# EAGLE design untitled (EAGLE 9.6.2)
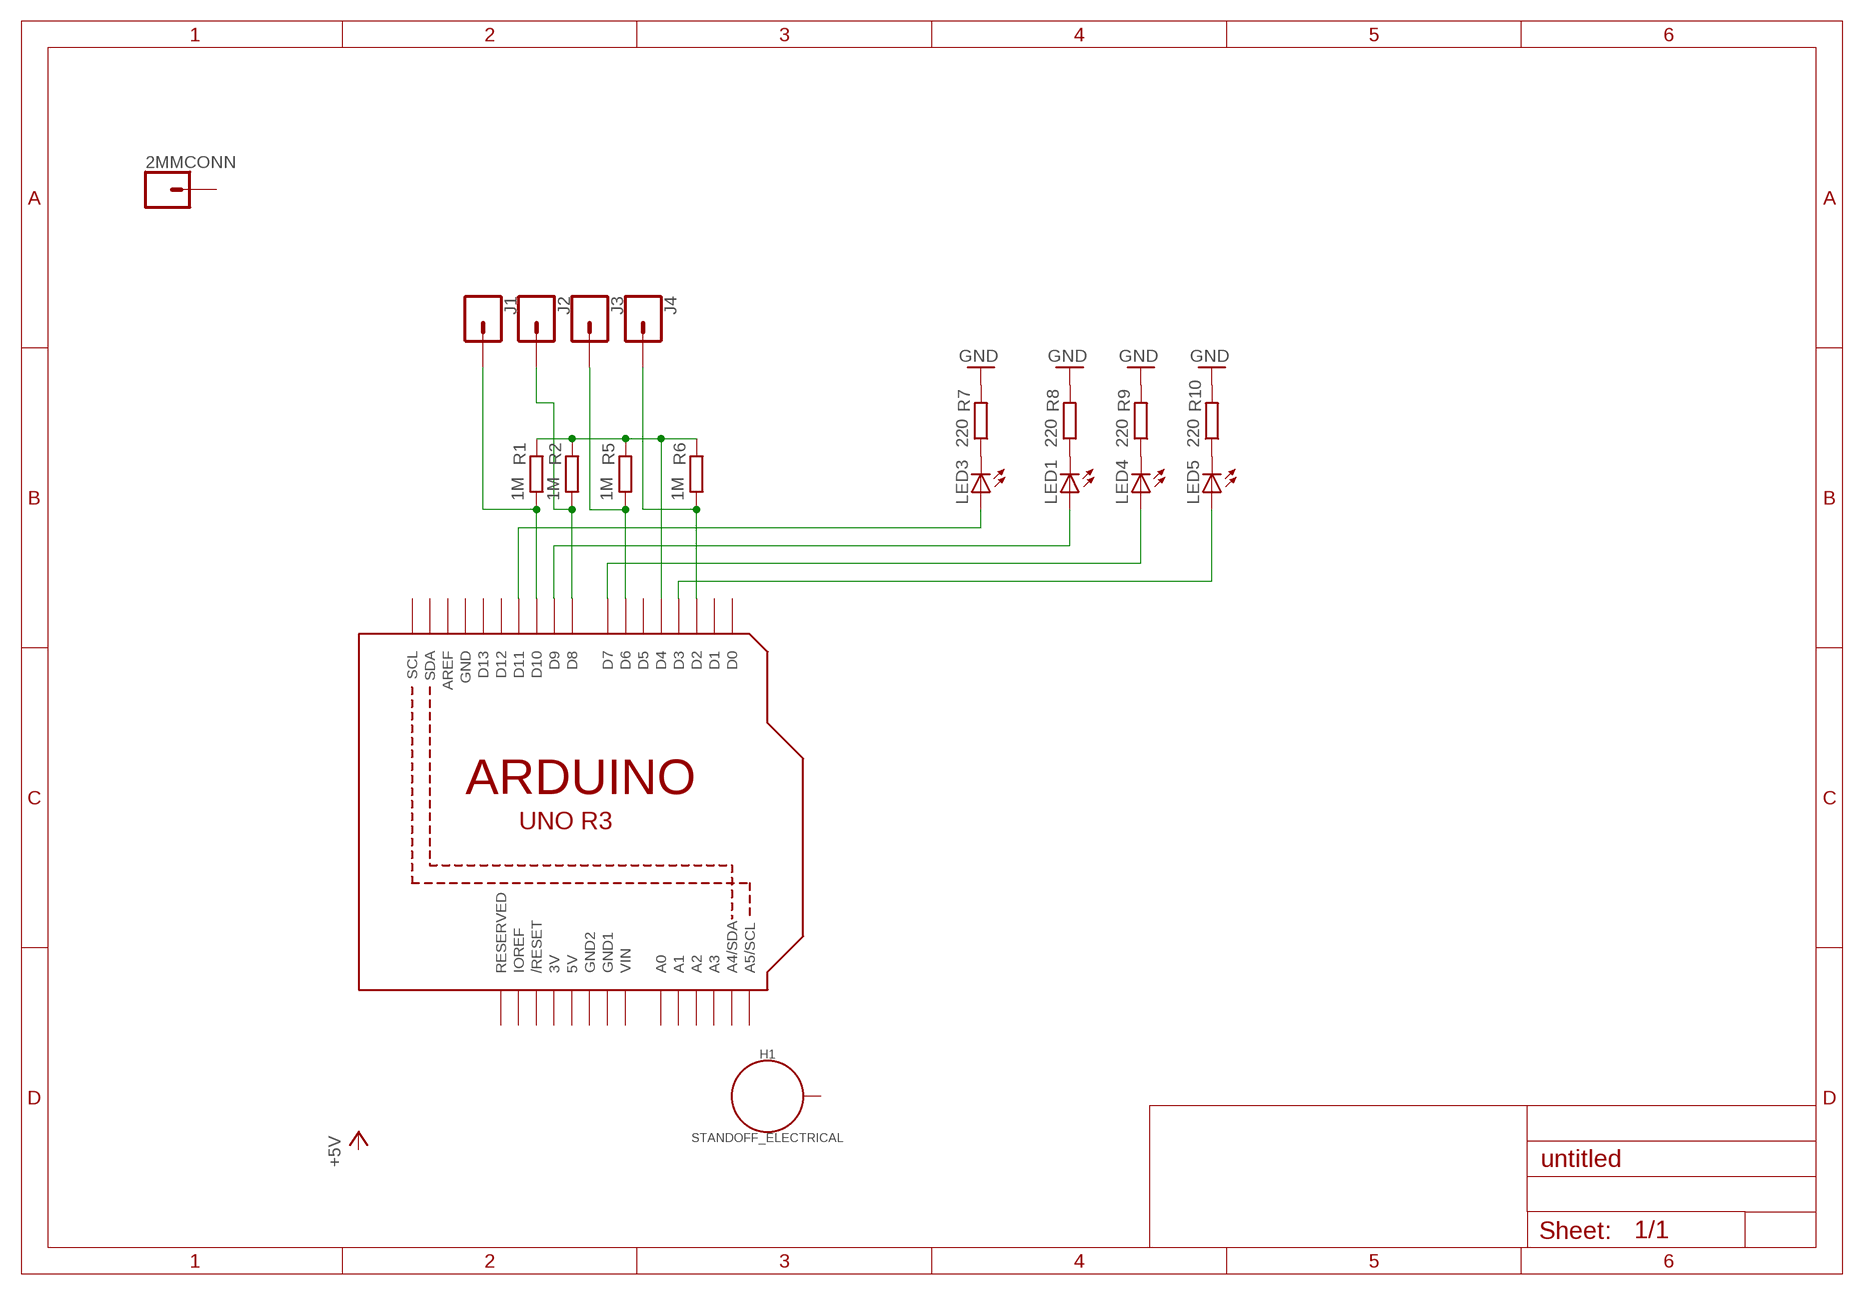
[diagram p0: schematic, sheet 1]

## Parts
2MMCONN  CONN_01PTH_2MM  [1X01_2MM]
H1  STANDOFF_ELECTRICAL  [STANDOFF-ELECTRICAL]
J1  CONN_01  [1X01]
J2  CONN_01  [1X01]
J3  CONN_01  [1X01]
J4  CONN_01  [1X01]
LED1  LED3MM  [LED3MM]
LED3  LED3MM  [LED3MM]
LED4  LED3MM  [LED3MM]
LED5  LED3MM  [LED3MM]
R1  1M  R-EU_0207/10  [0207/10]
R2  1M  R-EU_0207/10  [0207/10]
R5  1M  R-EU_0207/10  [0207/10]
R6  1M  R-EU_0207/10  [0207/10]
R7  220  R-EU_0207/10  [0207/10]
R8  220  R-EU_0207/10  [0207/10]
R9  220  R-EU_0207/10  [0207/10]
R10  220  R-EU_0207/10  [0207/10]
U1  ARDUINOR3-DIMENSION  [ARDUINOR3]

## Nets
GND [power]: R7.2 R8.2 R9.2 R10.2
N$1: J1.1 R1.1 U1.D10
N$2: R1.2 R2.2 R5.2 R6.2 U1.D4
N$3: LED5.A U1.D3
N$4: J4.1 R6.1 U1.D2
N$9: J3.1 R5.1 U1.D6
N$10: J2.1 R2.1 U1.D8
N$11: LED4.A U1.D7
N$12: LED1.A U1.D9
N$13: LED3.K(C) R7.1
N$14: LED3.A U1.D11
N$15: LED1.K(C) R8.1
N$16: LED4.K(C) R9.1
N$17: LED5.K(C) R10.1
Unconnected: 2MMCONN.1 H1.P1 U1.A0 U1.A1 U1.A2 U1.A3 U1.A4(A4/SDA) U1.A5(A5/SCL) U1.AREF U1.D0 U1.D1 U1.D5 U1.D12 U1.D13 U1.IOREF U1.RESERVED U1.RESET(/RESET) U1.SCL U1.SDA

## Power pins joined to a net without a drawn wire
3V: U1.3V
5V: U1.5V
GND: U1.GND
GND1: U1.GND1
GND2: U1.GND2
VIN: U1.VIN

## Library data of the parts
2MMCONN J1-J4 = SparkFun-Connectors:CONN_01: Single connection point. Often used as Generic Header-pin footprint for 0.1 inch spaced/style header connections On any of the 0.1 inch spaced packages, you can populate with these: Break Away Headers - Straight <https://www.sparkfun.com/products/116> (PRT-00116) Break Away Male Headers - Right Angle <https://www.sparkfun.com/products/553> (PRT-00553) Female Headers <https://www.sparkfun.com/products/115> (PRT-00115) Break Away Headers - Machine Pin <https://www.sparkfun.com/products/117> (PRT-00117) Break Away Female Headers - Swiss Machine Pin <https://www.sparkfun.com/products/743> (PRT-00743) This device is also useful as a general connection point to wire up your design to another part of your project. Our various solder wires solder well into these plated through hole pads. Hook-Up Wire - Assortment (Stranded, 22 AWG) <https://www.sparkfun.com/products/11375> (PRT-11375) Hook-Up Wire - Assortment (Solid Core, 22 AWG) <https://www.sparkfun.com/products/11367> (PRT-11367) View the entire wire category on our website here <https://www.sparkfun.com/categories/141> Special notes: SMTSO-256-ET is a "flush mount" nut for a 4-40 screw. We mostly use this on specialty testbeds; it is a nice way to connect hardware to your PCB at an adjustable hieght. Also note, the SNAP packages are for using a snappable style connector. We sell a baggie of snaps and they are also used on two LilyPad designs: Snap Assortment - 30 pack (male and female) <https://www.sparkfun.com/products/11347> (DEV-11347) LilyPad Arduino SimpleSnap <https://www.sparkfun.com/products/10941> (DEV-10941) LilyPad SimpleSnap Protoboard <https://www.sparkfun.com/products/10940> (DEV-10940)
H1 = EL311 2021:STANDOFF_ELECTRICAL: Stand Off Drill holes with an electrical connection. For example, use these to ground your board to a chassis. Example SparkFun Products Screw - Phillips Head (1/4", 4-40, 10 pack) <https://www.sparkfun.com/products/10453> (PRT-10453) Screw - Phillips Head (1/2", 4-40, 10 pack) <https://www.sparkfun.com/products/10452> (PRT-10452) Screw - Phillips Head (3/4", 4-40, 10 pack) <https://www.sparkfun.com/products/10451> (PRT-10451) Screw - Phillips Head (1", 4-40, 10 pack) <https://www.sparkfun.com/products/10450> (PRT-10450)
LED1 LED3-LED5 = EL311 2021:LED: LED OSRAM: - CHIPLED LG R971, LG N971, LY N971, LG Q971, LY Q971, LO R971, LY R971 LH N974, LH R974 LS Q976, LO Q976, LY Q976 LO Q996 - Hyper CHIPLED LW Q18S LB Q993, LB Q99A, LB R99A - SideLED LS A670, LO A670, LY A670, LG A670, LP A670 LB A673, LV A673, LT A673, LW A673 LH A674 LY A675 LS A676, LA A676, LO A676, LY A676, LW A676 LS A679, LY A679, LG A679 - Hyper Micro SIDELED® LS Y876, LA Y876, LO Y876, LY Y876 LT Y87S - SmartLED LW L88C, LW L88S LB L89C, LB L89S, LG L890 LS L89K, LO L89K, LY L89K LS L896, LA L896, LO L896, LY L896 - TOPLED LS T670, LO T670, LY T670, LG T670, LP T670 LSG T670, LSP T670, LSY T670, LOP T670, LYG T670 LG T671, LOG T671, LSG T671 LB T673, LV T673, LT T673, LW T673 LH T674 LS T676, LA T676, LO T676, LY T676, LB T676, LH T676, LSB T676, LW T676 LB T67C, LV T67C, LT T67C, LS T67K, LO T67K, LY T67K, LW E67C LS E67B, LA E67B, LO E67B, LY E67B, LB E67C, LV E67C, LT E67C LW T67C LS T679, LY T679, LG T679 LS T770, LO T770, LY T770, LG T770, LP T770 LB T773, LV T773, LT T773, LW T773 LH T774 LS E675, LA E675, LY E675, LS T675 LS T776, LA T776, LO T776, LY T776, LB T776 LHGB T686 LT T68C, LB T68C - Hyper Mini TOPLED® LB M676 - Mini TOPLED Santana® LG M470 LS M47K, LO M47K, LY M47K Source: http://www.osram.convergy.de/
R1 R2 R5-R10 = EL311 2021:R-EU_: RESISTOR, European symbol
U1 = adafruit:ARDUINOR3: This is a new object for the new Arduino R3 - with extra pins that you may want to use (such as IOref, and duplicated A4/A5

## Net classes
0 default: width 0.406 mm, drill 0.305 mm, clearance 0.305 mm
1 power: width 0.635 mm, drill 0.406 mm, clearance 0.457 mm

## Board
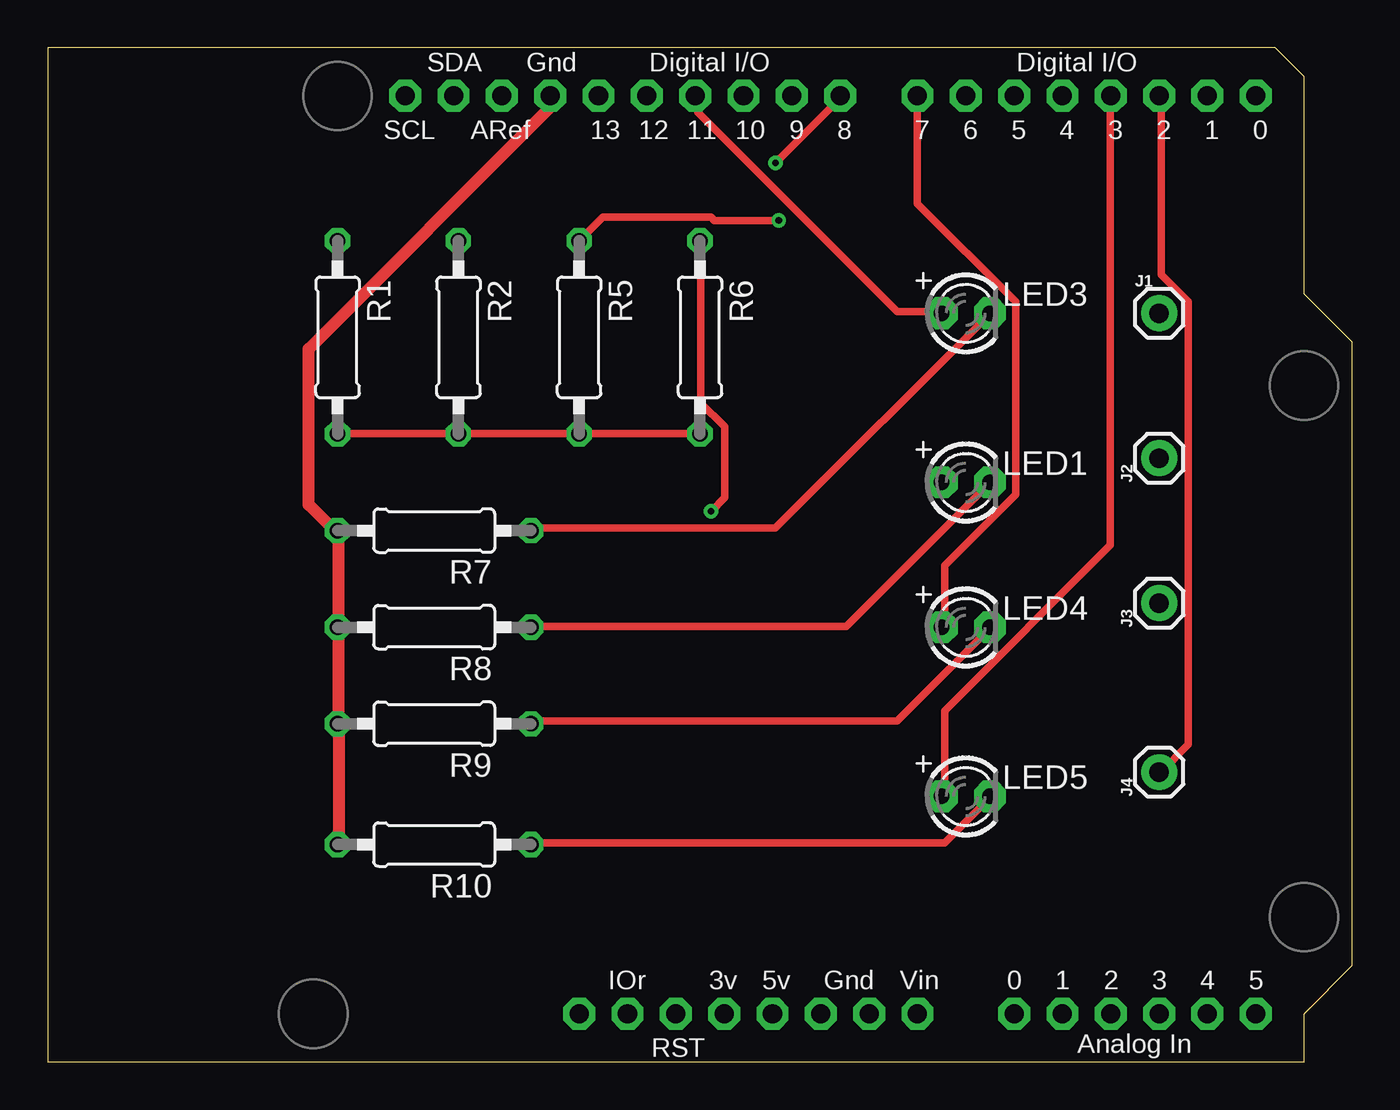
[diagram p1: board, top side]
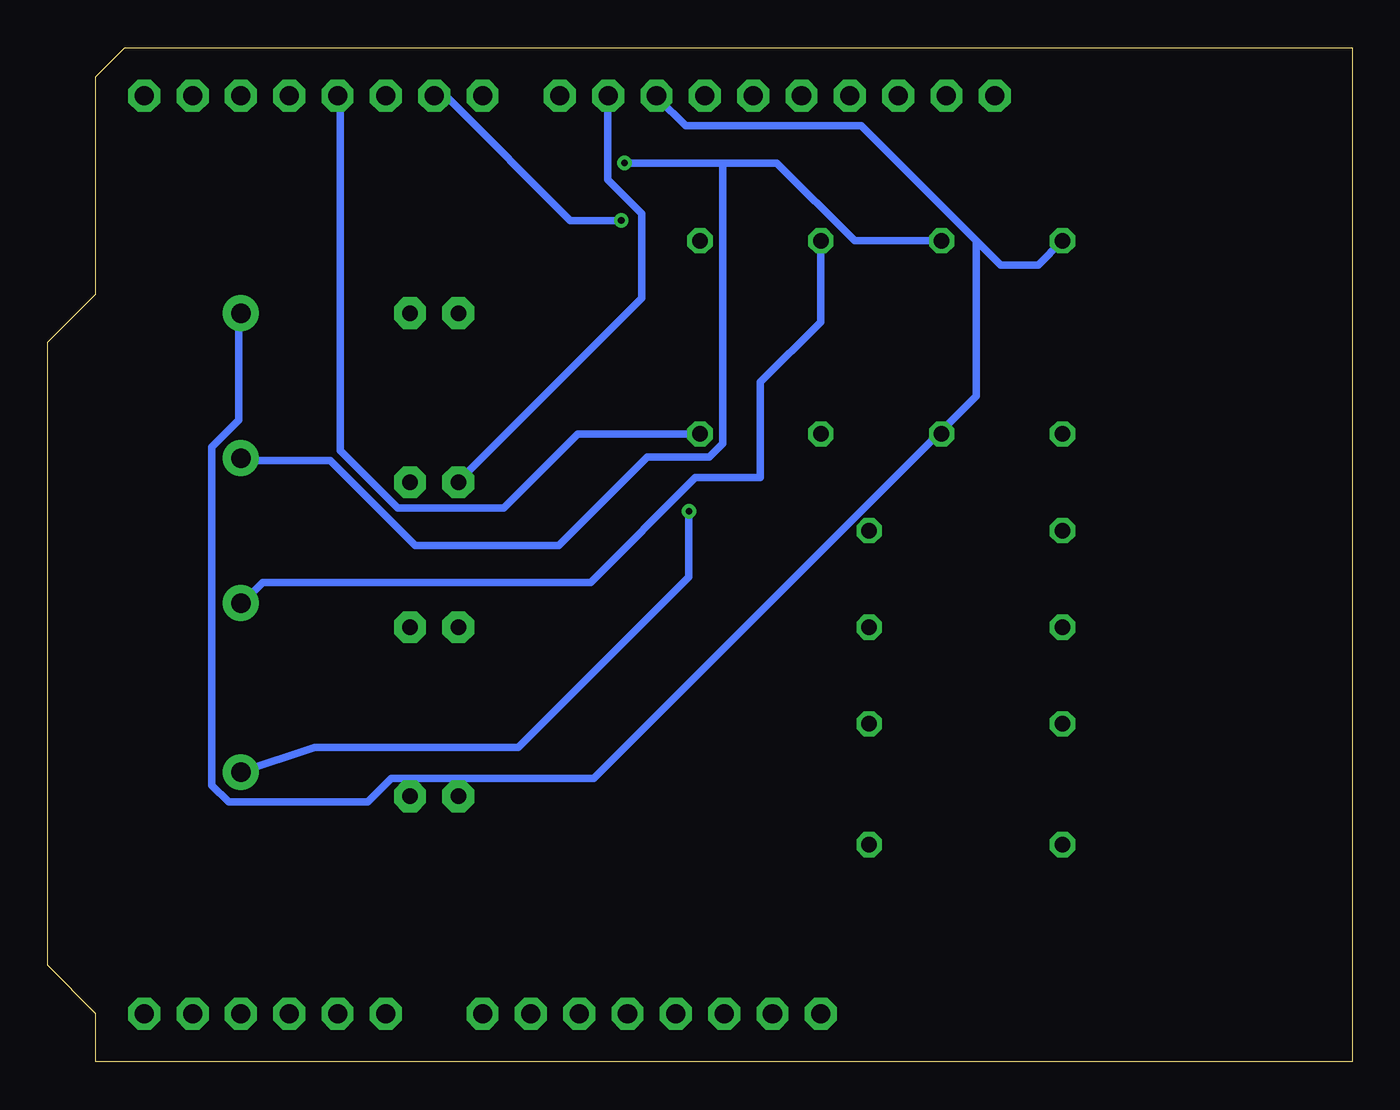
[diagram p2: board, bottom side, seen from below]

Size 68.58 x 53.34 mm. Coordinates in mm from the lower left corner, seen from the top.
Copper layers (1*16): Top 0.035mm / dielectric 1.5mm / Bottom 0.035mm
Design rules "default": minimum track width 6mil, minimum drill 0.35mm, track to track 6mil, track to pad 6mil, pad to pad 6mil, via to via 6mil, smd to smd 6mil, copper to edge 40mil, drill to drill 6mil, minimum pad ring 10mil, minimum via ring 8mil, stop-mask expansion 4mil, vias tented up to drill 0mil, thermal gap 10mil

### Footprints (pad centres in the part's own frame; a part is rotated, then mirrored left to right if it is on the bottom)
1X01_2MM = drill 2 pad 3.302: 1 0,0
STANDOFF-ELECTRICAL = drill 3.2 pad 6.35: P1 0,0
1X01 = drill 1.016 pad 1.88: 1 0,0
LED3MM = drill 0.813 pad 1.676 octagon: A -1.27,0; K 1.27,0
0207/10 = drill 0.813 octagon: 1 -5.08,0; 2 5.08,0
ARDUINOR3 = drill 1 pad 1.676 octagon: 3V 35.56,2.54; 5V 38.1,2.54; A0 50.8,2.54; A1 53.34,2.54; A2 55.88,2.54; A3 58.42,2.54; A4 60.96,2.54; A5 63.5,2.54; AREF 23.876,50.8; D0 63.5,50.8; D1 60.96,50.8; D2 58.42,50.8; D3 55.88,50.8; D4 53.34,50.8; D5 50.8,50.8; D6 48.26,50.8; D7 45.72,50.8; D8 41.656,50.8; D9 39.116,50.8; D10 36.576,50.8; D11 34.036,50.8; D12 31.496,50.8; D13 28.956,50.8; GND 26.416,50.8; GND1 43.18,2.54; GND2 40.64,2.54; IOREF 30.48,2.54; RESERVED 27.94,2.54; RESET 33.02,2.54; SCL 18.796,50.8; SDA 21.336,50.8; VIN 45.72,2.54

### Placement (x,y rotation side)
2MMCONN  6.35,-11.43 0 top  (outside the outline)
H1  16.51,-11.43 0 top  (outside the outline)
J1  58.42,39.37 0 top
J2  58.42,31.75 90 top
J3  58.42,24.13 90 top
J4  58.42,15.24 90 top
LED1  48.26,30.48 0 top
LED3  48.26,39.37 0 top
LED4  48.26,22.86 0 top
LED5  48.26,13.97 0 top
R1  15.24,38.1 270 top
R2  21.59,38.1 270 top
R5  27.94,38.1 270 top
R6  34.29,38.1 270 top
R7  20.32,27.94 180 top
R8  20.32,22.86 180 top
R9  20.32,17.78 180 top
R10  20.32,11.43 180 top
U1  0,0 0 top

### Tracks (layer width: path | path; a pad name or v marks a point on that pad's centre or on a via)
GND
  Top 0.635: R10.2 15.32,11.53 15.32,17.76 R9.2 15.32,17.93 15.32,22.73 R8.2 15.32,23.09 15.32,27.89 R7.2 14.96,28.07 13.72,29.31 13.72,37.49 26.34,50.11 26.34,50.65 U1.GND
N$1
  Bottom 0.406: R1.1 16.51,41.91 18.49,41.91 19.76,43.18 | 19.76,43.18 25.81,49.23 35.05,49.23 36.47,50.65 U1.D10 | J1.1 58.52,39.27 58.52,33.76 59.94,32.33 59.94,14.55 59.05,13.67 51.77,13.67 50.52,14.91 39.88,14.91 19.76,35.03 19.76,43.18
N$2
  Top 0.406: R1.2 15.32,33.05 21.54,33.05 R2.2 21.72,33.05 27.94,33.05 R5.2 28.12,33.05 34.16,33.05 R6.2
  Bottom 0.406: U1.D4 53.19,50.65 53.19,32.16 50.16,29.13 44.6,29.13 40.72,33.02 R6.2
N$3
  Top 0.406: LED5.A 47.14,14.02 47.14,18.47 55.85,27.18 55.85,50.65 U1.D3
N$4  (via drill 0.35)
  Top 0.406: v34.87,28.96 35.58,29.67 35.58,33.4 34.34,34.65 34.34,43.18 R6.1 | U1.D2 58.52,50.65 58.52,41.4 59.94,39.98 59.94,16.69 58.52,15.27 J4.1
  Bottom 0.406: v34.87,28.96 34.87,25.5 43.84,16.54 54.53,16.54 J4.1
N$9  (via drill 0.35)
  Top 0.406: v38.43,44.25 35.05,44.25 34.87,44.42 29.18,44.42 R5.1
  Bottom 0.406: R5.1 27.94,38.91 31.11,35.74 31.11,30.73 34.52,30.73 34.53,30.72 40.03,25.22 57.28,25.22 58.34,24.16 J3.1 | v38.43,44.25 41.1,44.25 47.5,50.65 48.21,50.65 U1.D6
N$10  (via drill 0.35)
  Top 0.406: v38.25,47.27 41.63,50.65 U1.D8
  Bottom 0.406: R2.1 26.16,43.18 30.25,47.27 33.1,47.27 | v38.25,47.27 33.1,47.27 | 33.1,47.27 33.1,32.51 33.81,31.8 37.06,31.8 41.71,27.15 49.25,27.15 53.72,31.62 58.34,31.62 J2.1
N$11
  Top 0.406: U1.D7 45.72,45.14 50.88,39.98 50.88,29.85 47.14,26.11 47.14,22.91 LED4.A
N$12
  Bottom 0.406: U1.D9 39.14,50.65 39.14,46.38 37.36,44.6 37.36,40.16 46.97,30.56 LED1.A
N$13
  Top 0.406: R7.1 25.45,28.07 38.25,28.07 49.45,39.27 LED3.K
N$14
  Top 0.406: LED3.A 46.97,39.45 44.65,39.45 34.16,49.94 34.16,50.65 U1.D11
N$15
  Top 0.406: R8.1 25.45,22.91 41.99,22.91 49.45,30.38 LED1.K
N$16
  Top 0.406: R9.1 25.45,17.93 44.65,17.93 49.45,22.73 LED4.K
N$17
  Top 0.406: R10.1 25.45,11.53 47.14,11.53 49.45,13.84 LED5.K